# Altium schematic sheet BMS_INV_V2.SchDoc
size A1; SheetNumber: 1; SheetTotal: 1
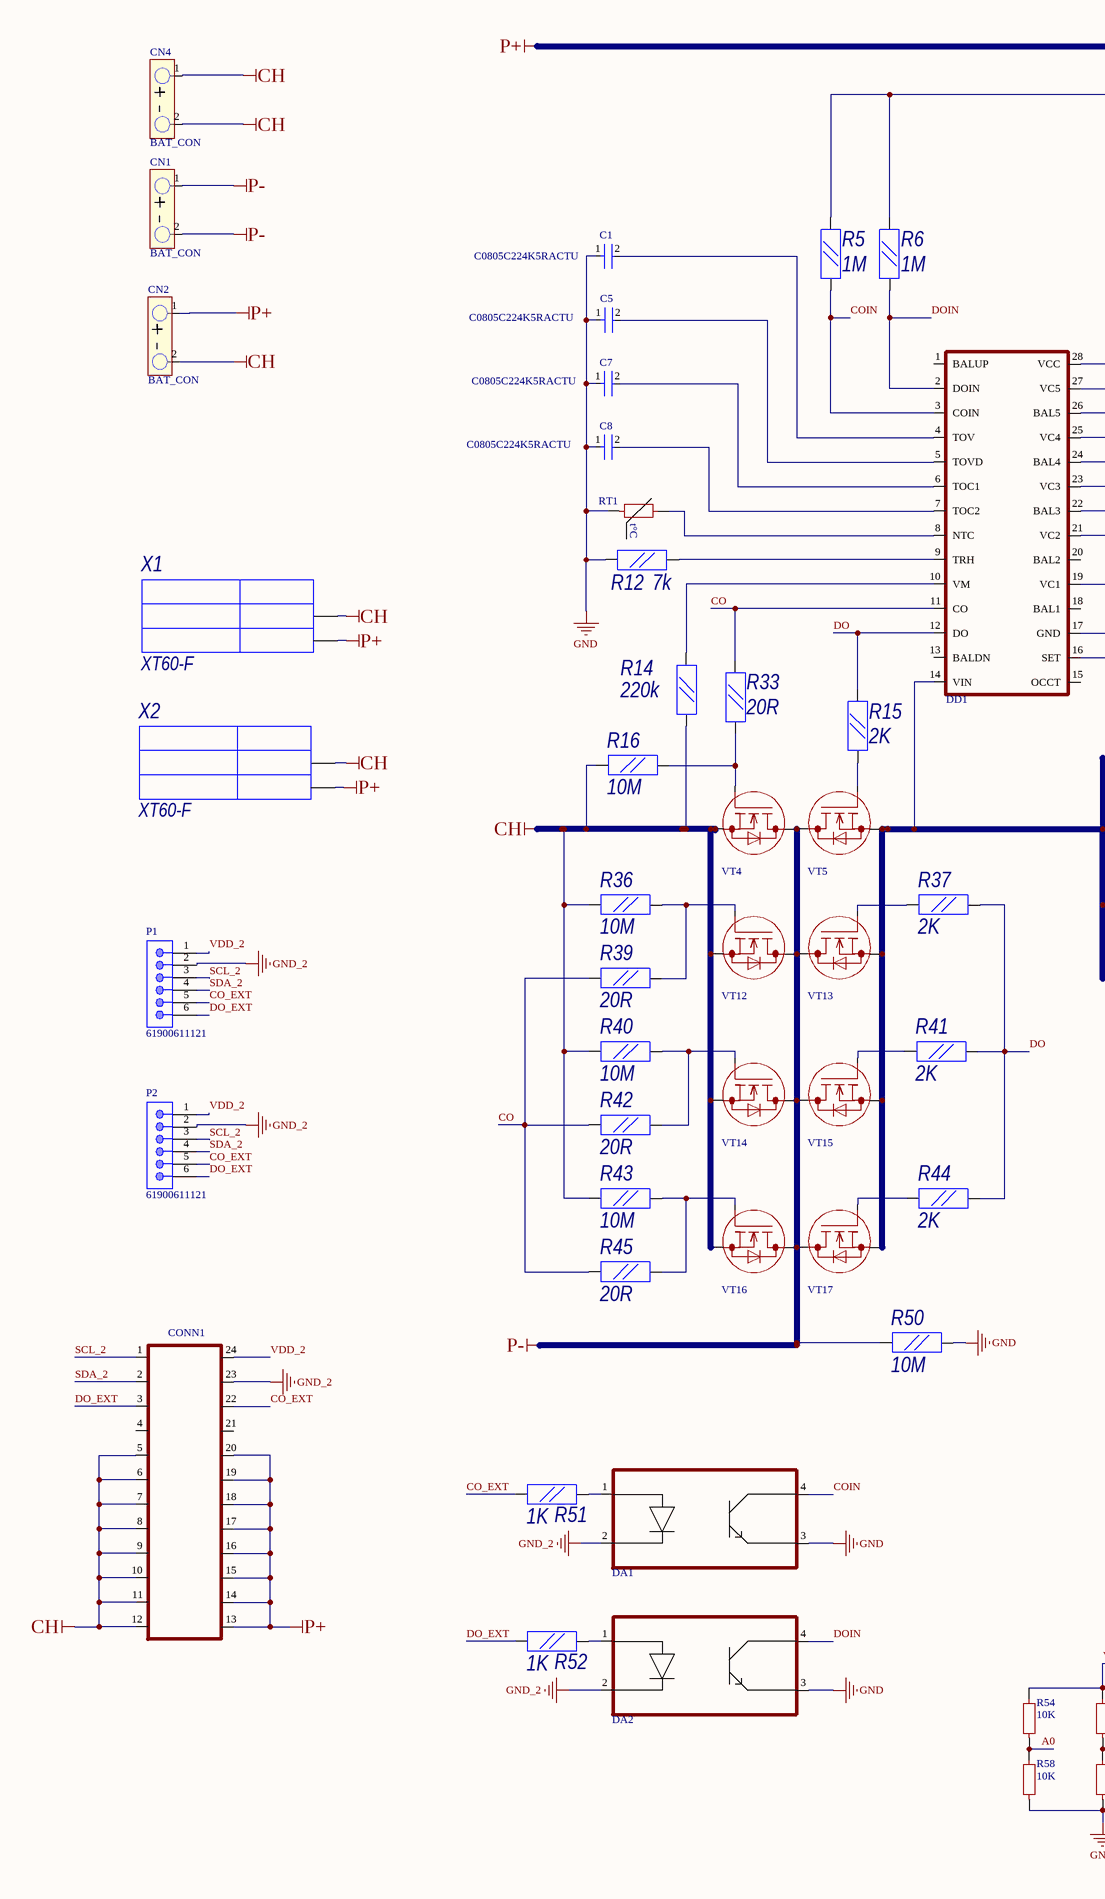
[diagram p0: BMS_INV_V2.SchDoc, left]
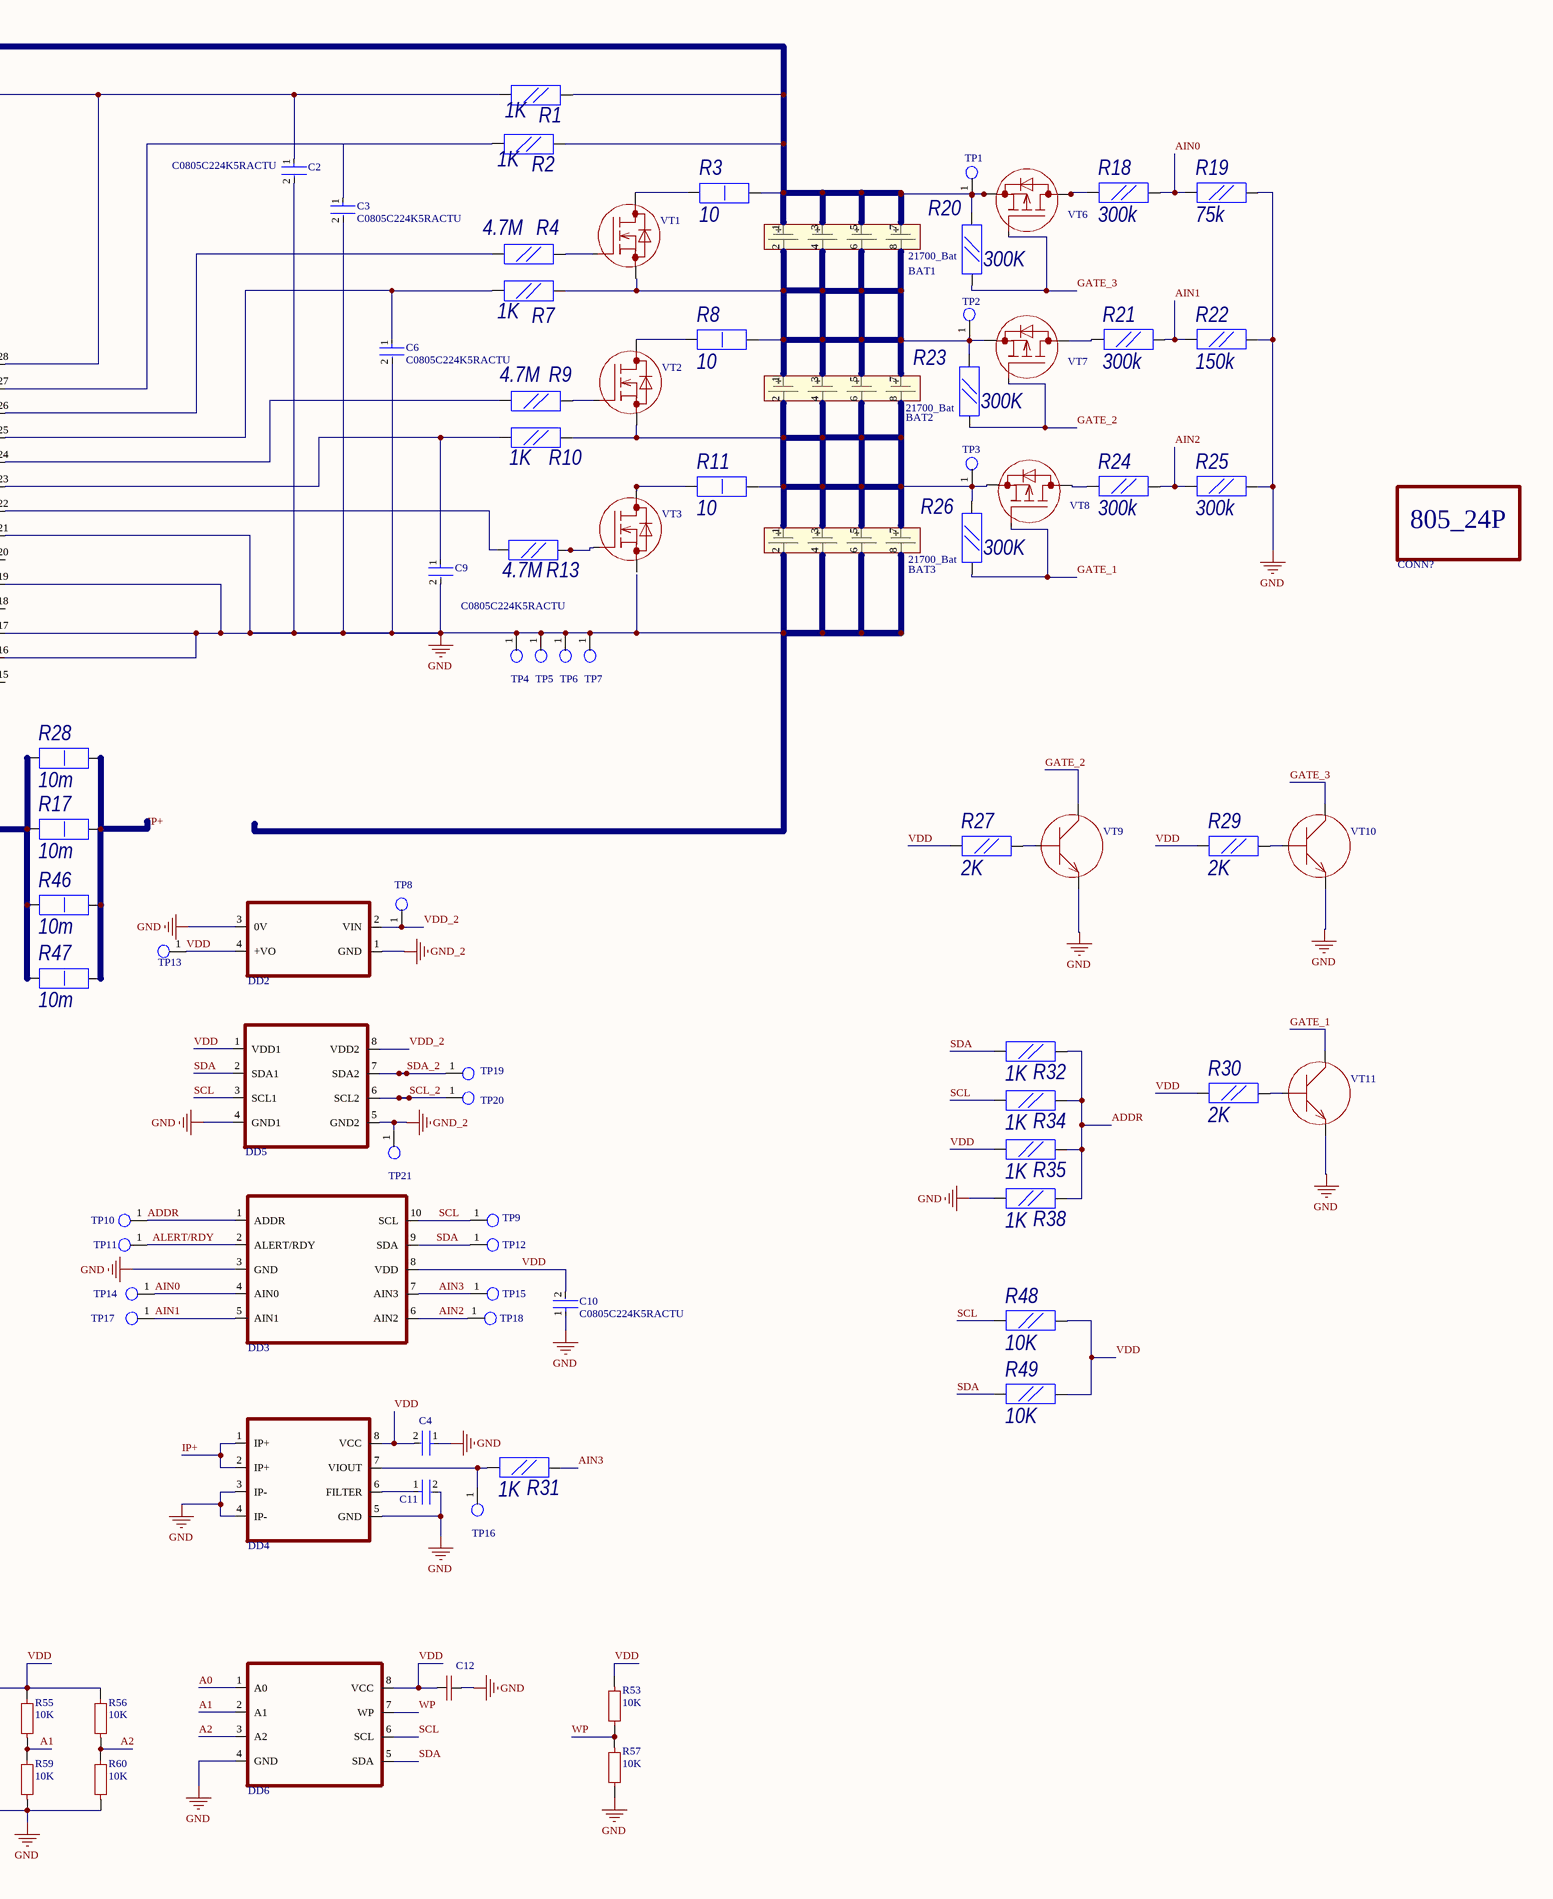
[diagram p1: BMS_INV_V2.SchDoc, right]

## Parts
BAT1  21700_Bat  [21700_BAT]
BAT2  21700_Bat  [21700_BAT]
BAT3  21700_Bat  [21700_BAT]
C1  C0805C224K5RACTU  [FP-C0805C-DN-IPC_A]
C2  C0805C224K5RACTU  [FP-C0805C-DN-IPC_A]
C3  C0805C224K5RACTU  [FP-C0805C-DN-IPC_A]
C4  C0805C224K5RACTU  [FP-C0805C-DN-IPC_A]  (value not drawn)
C5  C0805C224K5RACTU  [FP-C0805C-DN-IPC_A]
C6  C0805C224K5RACTU  [FP-C0805C-DN-IPC_A]
C7  C0805C224K5RACTU  [FP-C0805C-DN-IPC_A]
C8  C0805C224K5RACTU  [FP-C0805C-DN-IPC_A]
C9  C0805C224K5RACTU  [FP-C0805C-DN-IPC_A]
C10  C0805C224K5RACTU  [FP-C0805C-DN-IPC_A]
C11  C0805C224K5RACTU  [FP-C0805C-DN-IPC_A]  (value not drawn)
C12  CAP-NON-POLAR  [CAP-0603]  (value not drawn)
CN1  BAT_CON  [Batarey_connector 3mm]
CN2  BAT_CON  [Batarey_connector]
CN4  BAT_CON  [Batarey_connector 3mm]
CONN1  CONN_805_24P  [CONN_805_24P]  (value not drawn)
CONN?  805_24P  [805_24P]  (value not drawn)
DA1  PC817  [4-SMD]  (value not drawn)
DA2  PC817  [4-SMD]  (value not drawn)
DD1  BM3451  [TSSOP-28]  (value not drawn)
DD2  B0505S-1W  [PLS-4-2.54mm]  (value not drawn)
DD3  ADS1115  [10VSSOP]  (value not drawn)
DD4  ACS712  [SO8-150]  (value not drawn)
DD5  ADUM1250ARZ  [SO8-150]  (value not drawn)
DD6  24C256  [SO8-150]  (value not drawn)
P1  61900611121  [61900611121]
P2  61900611121  [61900611121]
R1  1K  [R-0805]
R2  1K  [R-0805]
R3  10  [R-2512]
R4  4.7M  [R-0805]
R5  1M  [R-0805]
R6  1M  [R-0805]
R7  1K  [R-0805]
R8  10  [R-2512]
R9  4.7M  [R-0805]
R10  1K  [R-0805]
R11  10  [R-2512]
R12  7k  [R-0805]
R13  4.7M  [R-0805]
R14  220k  [R-0805]
R15  2K  [R-0805]
R16  10M  [R-0805]
R17  10m  [R-2512]
R18  300k  [R-0805]
R19  75k  [R-0805]
R20  300K  [R-0805]
R21  300k  [R-0805]
R22  150k  [R-0805]
R23  300K  [R-0805]
R24  300k  [R-0805]
R25  300k  [R-0805]
R26  300K  [R-0805]
R27  2K  [R-0805]
R28  10m  [R-2512]
R29  2K  [R-0805]
R30  2K  [R-0805]
R31  1K  [R-0805]
R32  1K  [R-0805]
R33  20R  [R-0805]
R34  1K  [R-0805]
R35  1K  [R-0805]
R36  10M  [R-0805]
R37  2K  [R-0805]
R38  1K  [R-0805]
R39  20R  [R-0805]
R40  10M  [R-0805]
R41  2K  [R-0805]
R42  20R  [R-0805]
R43  10M  [R-0805]
R44  2K  [R-0805]
R45  20R  [R-0805]
R46  10m  [R-2512]
R47  10m  [R-2512]
R48  10K  [R-0805]
R49  10K  [R-0805]
R50  10M  [R-0805]
R51  1K  [R-0805]
R52  1K  [R-0805]
R53  10K  [RES-0603]
R54  10K  [RES-0603]
R55  10K  [RES-0603]
R56  10K  [RES-0603]
R57  10K  [RES-0603]
R58  10K  [RES-0603]
R59  10K  [RES-0603]
R60  10K  [RES-0603]
RT1  RES-TEMP  [NTC_MF52]  (value not drawn)
TP1  Test_Point_PCB  [Test_Point]  (value not drawn)
TP2  Test_Point_PCB  [Test_Point]  (value not drawn)
TP3  Test_Point_PCB  [Test_Point]  (value not drawn)
TP4  Test_Point_PCB  [Test_Point]  (value not drawn)
TP5  Test_Point_PCB  [Test_Point]  (value not drawn)
TP6  Test_Point_PCB  [Test_Point]  (value not drawn)
TP7  Test_Point_PCB  [Test_Point]  (value not drawn)
TP8  Test_Point_PCB  [Test_Point]  (value not drawn)
TP9  Test_Point_PCB  [Test_Point]  (value not drawn)
TP10  Test_Point_PCB  [Test_Point]  (value not drawn)
TP11  Test_Point_PCB  [Test_Point]  (value not drawn)
TP12  Test_Point_PCB  [Test_Point]  (value not drawn)
TP13  Test_Point_PCB  [Test_Point]  (value not drawn)
TP14  Test_Point_PCB  [Test_Point]  (value not drawn)
TP15  Test_Point_PCB  [Test_Point]  (value not drawn)
TP16  Test_Point_PCB  [Test_Point]  (value not drawn)
TP17  Test_Point_PCB  [Test_Point]  (value not drawn)
TP18  Test_Point_PCB  [Test_Point]  (value not drawn)
TP19  Test_Point_PCB  [Test_Point]  (value not drawn)
TP20  Test_Point_PCB  [Test_Point]  (value not drawn)
TP21  Test_Point_PCB  [Test_Point]  (value not drawn)
VT1  MOSFET-N-GSD  [SOT23-3]  (value not drawn)
VT2  MOSFET-N-GSD  [SOT23-3]  (value not drawn)
VT3  MOSFET-N-GSD  [SOT23-3]  (value not drawn)
VT4  MOSFET-N-GDS  [TO-220-5]  (value not drawn)
VT5  MOSFET-N-GDS  [TO-220-5]  (value not drawn)
VT6  MOSFET-P-CH  [SOT23-3]  (value not drawn)
VT7  MOSFET-P-CH  [SOT23-3]  (value not drawn)
VT8  MOSFET-P-CH  [SOT23-3]  (value not drawn)
VT9  BC847-BEC  [SOT23-3]  (value not drawn)
VT10  BC847-BEC  [SOT23-3]  (value not drawn)
VT11  BC847-BEC  [SOT23-3]  (value not drawn)
VT12  MOSFET-N-GDS  [TO-220-5]  (value not drawn)
VT13  MOSFET-N-GDS  [TO-220-5]  (value not drawn)
VT14  MOSFET-N-GDS  [TO-220-5]  (value not drawn)
VT15  MOSFET-N-GDS  [TO-220-5]  (value not drawn)
VT16  MOSFET-N-GDS  [TO-220-5]  (value not drawn)
VT17  MOSFET-N-GDS  [TO-220-5]  (value not drawn)
X1  XT60-F  [XT60-F AMASS]
X2  XT60-F  [XT60-F AMASS]

## Nets
CH: CN2.2(-) CN4.1(+) CN4.2(-) CONN1.5 CONN1.6 CONN1.7 CONN1.8 CONN1.9 CONN1.10 CONN1.11 CONN1.12 R14.2 R16.2 R36.2 R40.2 R43.2 VT4.3(S) VT12.3(S) VT14.3(S) VT16.3(S) X1.1 X2.1
GND: BAT3.2(-1S) BAT3.4(-2S) BAT3.6(-3S) BAT3.8(-4S) C1.1 C2.2 C3.2 C4.1 C5.1 C6.2 C7.1 C8.1 C9.2 C10.1 C11.2 C12.1 DA1.3(EMITTER) DA2.3(EMITTER) DD1.16(SET) DD1.17(GND) DD1.19(VC1) DD1.21(VC2) DD2.3(0V) DD3.3(GND) DD4.3(IP-) DD4.4(IP-) DD4.5(GND) DD5.4(GND1) DD6.4(GND) R12.1 R19.1 R22.1 R25.1 R38.2 R50.1 R57.2 R58.1 R59.1 R60.1 RT1.1 TP4.1(G9) TP5.1(G9) TP6.1(G9) TP7.1(G9) VT9.2(E) VT10.2(E) VT11.2(E)
GND_2: CONN1.23 DA1.2(CATHODE) DA2.2(CATHODE) DD2.1(GND) DD5.5(GND2) P1.2 P2.2 TP21.1(G9)
P+: BAT1.1(+1S) BAT1.3(+2S) BAT1.5(+3S) BAT1.7(+4S) CN2.1(+) CONN1.13 CONN1.14 CONN1.15 CONN1.16 CONN1.17 CONN1.18 CONN1.19 CONN1.20 R1.2 R2.2 R3.2 R20.1 TP1.1(G9) VT6.2(S) X1.2 X2.2
P-: CN1.1(+) CN1.2(-) R50.2 VT4.2(D) VT5.2(D) VT12.2(D) VT13.2(D) VT14.2(D) VT15.2(D) VT16.2(D) VT17.2(D)
A0: DD6.1(A0) R54.1 R58.2
A1: DD6.2(A1) R55.1 R59.2
A2: DD6.3(A2) R56.1 R60.2
ADDR: DD3.1(ADDR) R32.1 R34.1 R35.1 R38.1 TP10.1(G9)
AIN0: DD3.4(AIN0) R18.1 R19.2 TP14.1(G9)
AIN1: DD3.5(AIN1) R21.1 R22.2 TP17.1(G9)
AIN2: DD3.6(AIN2) R24.1 R25.2 TP18.1(G9)
AIN3: DD3.7(AIN3) R31.1 TP15.1(G9)
ALERT/RDY: DD3.2(ALERT/RDY) TP11.1(G9)
CO: DD1.11(CO) R33.1 R39.2 R42.2 R45.2
CO_EXT: CONN1.22 P1.5 P2.5 R51.2
COIN: DA1.4(COLLECTOR) DD1.3(COIN) R5.1
DO: DD1.12(DO) R15.2 R37.1 R41.1 R44.1
DO_EXT: CONN1.3 P1.6 P2.6 R52.2
DOIN: DA2.4(COLLECTOR) DD1.2(DOIN) R6.1
GATE_1: R26.2 VT8.1(G) VT11.3(C)
GATE_2: R23.2 VT7.1(G) VT9.3(C)
GATE_3: R20.2 VT6.1(G) VT10.3(C)
IP+: DD4.1(IP+) DD4.2(IP+) R17.2 R28.2 R46.2 R47.2
SCL: DD3.10(SCL) DD5.3(SCL1) DD6.6(SCL) R34.2 R48.2 TP9.1(G9)
SCL_2: CONN1.1 DD5.6(SCL2) P1.3 P2.3 TP20.1(G9)
SDA: DD3.9(SDA) DD5.2(SDA1) DD6.5(SDA) R32.2 R49.2 TP12.1(G9)
SDA_2: CONN1.2 DD5.7(SDA2) P1.4 P2.4 TP19.1(G9)
VDD: C4.2 C10.2 C12.2 DD2.4(+VO) DD3.8(VDD) DD4.8(VCC) DD5.1(VDD1) DD6.8(VCC) R27.2 R29.2 R30.2 R35.2 R48.1 R49.1 R53.1 R54.2 R55.2 R56.2 TP13.1(G9)
VDD_2: CONN1.24 DD2.2(VIN) DD5.8(VDD2) P1.1 P2.1 TP8.1(G9)
WP: DD6.7(WP) R53.2 R57.1
NetBAT1_2: BAT1.2(-1S) BAT1.4(-2S) BAT1.6(-3S) BAT1.8(-4S) BAT2.1(+1S) BAT2.3(+2S) BAT2.5(+3S) BAT2.7(+4S) R7.2 R8.2 R23.1 TP2.1(G9) VT7.2(S)
NetBAT2_2: BAT2.2(-1S) BAT2.4(-2S) BAT2.6(-3S) BAT2.8(-4S) BAT3.1(+1S) BAT3.3(+2S) BAT3.5(+3S) BAT3.7(+4S) R10.2 R11.2 R26.1 TP3.1(G9) VT2.2(S) VT8.2(S)
NetC1_2: C1.2 DD1.4(TOV)
NetC2_1: C2.1 DD1.28(VCC) R1.1 R5.2 R6.2
NetC3_1: C3.1 DD1.27(VC5) R2.1
NetC5_2: C5.2 DD1.5(TOVD)
NetC6_1: C6.1 DD1.25(VC4) R7.1
NetC7_2: C7.2 DD1.6(TOC1)
NetC8_2: C8.2 DD1.7(TOC2)
NetC9_1: C9.1 DD1.23(VC3) R10.1
NetC11_1: C11.1 DD4.6(FILTER)
NetDA1_1: DA1.1(ANODE) R51.1
NetDA2_1: DA2.1(ANODE) R52.1
NetDD1_8: DD1.8(NTC) RT1.2
NetDD1_9: DD1.9(TRH) R12.2
NetDD1_10: DD1.10(VM) R14.1
NetDD1_14: DD1.14(VIN) R17.1 R28.1 R46.1 R47.1 VT5.3(S) VT13.3(S) VT15.3(S) VT17.3(S)
NetDD1_22: DD1.22(BAL3) R13.1
NetDD1_24: DD1.24(BAL4) R9.1
NetDD1_26: DD1.26(BAL5) R4.1
NetDD4_7: DD4.7(VIOUT) R31.2 TP16.1(G9)
NetR3_1: R3.1 VT1.3(D)
NetR4_2: R4.2 VT1.1(G)
NetR8_1: R8.1 VT2.3(D)
NetR9_2: R9.2 VT2.1(G)
NetR11_1: R11.1 VT3.3(D)
NetR13_2: R13.2 VT3.1(G)
NetR15_1: R15.1 VT5.1(G)
NetR16_1: R16.1 R33.2 VT4.1(G)
NetR18_2: R18.2 VT6.3(D)
NetR21_2: R21.2 VT7.3(D)
NetR24_2: R24.2 VT8.3(D)
NetR27_1: R27.1 VT9.1(B)
NetR29_1: R29.1 VT10.1(B)
NetR30_1: R30.1 VT11.1(B)
NetR36_1: R36.1 R39.1 VT12.1(G)
NetR37_2: R37.2 VT13.1(G)
NetR40_1: R40.1 R42.1 VT14.1(G)
NetR41_2: R41.2 VT15.1(G)
NetR43_1: R43.1 R45.1 VT16.1(G)
NetR44_2: R44.2 VT17.1(G)

Not connected (* = marked no-connect by the designer): CONN1 4 21; DD1 1(BALUP) 13(BALDN) 15(OCCT) 18(BAL1) 20(BAL2); VT1 2(S); VT3 2(S)

## Notes on the sheet
- (in symbol RES-TEMP) t°C

## Library data of the parts
C1-C11 = CMP-1036-04552-2: CAP CER 0.22UF 50V X7R 0805; Manufacturer: KEMET; Value: 0.22 μF; Temperature Coefficient: 30ppm/°C; Material: Ceramic; Tolerance: 0.1; ComponentLink2URL: https://content.kemet.com/datasheets/KEM_C1003_C0G_SMD.pdf; Temperature Characteristic: X7R; Device Class L3: Ceramic Capacitors; Lead Free: Yes; Temperature: -55°C to +125°C; RoHS: TRUE; Capacitance: 0.22 μF; Automotive: No; Octopart: https://octopart.com/c0805c224k5ractu-kemet-144670; Manufacturer Part Number: C0805C224K5RACTU; Temperature Range Low: -55°C; Height: 0.88mm; Device Class L1: Passive Components; Digikey Description: CAP CER 0.22UF 50V X7R 0805; ComponentLink2Description: Datasheet; Mouser Description: CAP CER 0.22UF 50V X7R 0805; Category: Cap; Ipc Land Pattern Name: CAPC200125X78; Temperature Range High: +125°C; Package: C0805C-DN; Device Class L2: Capacitors; Voltage Rating: 50 V
CN1 CN2 CN4 = BAT_CON: Batarey_connection
P1 P2 = 61900611121: WR-WTB THT Male Vertical Locking Header, pitch 2.54mm, 6p; Pin Number: 6; Contact Resistance: 20mOhm; Rated Current: 3A; Withstanding Voltage: 1000VAC; Working Voltage: 250VAC; ComponentLink1Description: Manufacturer; ComponentLink1URL: http://www.we-online.de; ComponentLink2Description: Datasheet; ComponentLink2URL: https://www.we-online.com/catalog/datasheet/61900611121.pdf; Pitch: 2.54mm; Published Date: January 2020; Publisher: Wurth Elektronik; Mounting Technology: THT; Packaging: Bag; Operating Temperature: -40 to +105degC; Part Number: 61900611121; Gender: Male; Type: Vertical
R1 R2 R4-R7 R9 R10 R12-R16 R18-R27 R29-R45 R48-R52 = R0805: Резистор SMD; Tolerance: 5%; ComponentDescription: =ComponentType+', '+ Package +', '+Value+'Ом, ' + Tolerance; ComponentType: Резистор SMD; Package: R-0805
  R1 R2 R7 R10 R31 R32 R34 R35 R38 R51 R52: Value: 1K
  R4 R9 R13: Value: 4.7M
  R5 R6: Value: 1M
  R12: Value: 7k
  R14: Value: 220k
  R15 R27 R29 R30 R37 R41 R44: Value: 2K
  R16 R36 R40 R43 R50: Value: 10M
  R18 R21 R24 R25: Value: 300k
  R19: Value: 75k
  R20 R23 R26: Value: 300K
  R22: Value: 150k
  R33 R39 R42 R45: Value: 20R
  R48 R49: Value: 10K
R3 R8 R11 R17 R28 R46 R47 = R2512: Резистор SMD; Tolerance: 5%; ComponentDescription: =ComponentType+', '+ Package +', '+Value+'Ом, ' + Tolerance; ComponentType: Резистор SMD; Package: R-2512
  R3 R8 R11: Value: 10
  R17 R28 R46 R47: Value: 10m
R53-R60 = RES-CONST
TP1-TP21 = TP_PCB?: Test_Point
X1 X2 = XT60-F: Разъем; ComponentDescription: Разъём, XT60-F; ComponentTypе: Разъём